# EAGLE design Driver (EAGLE 7.7.0)
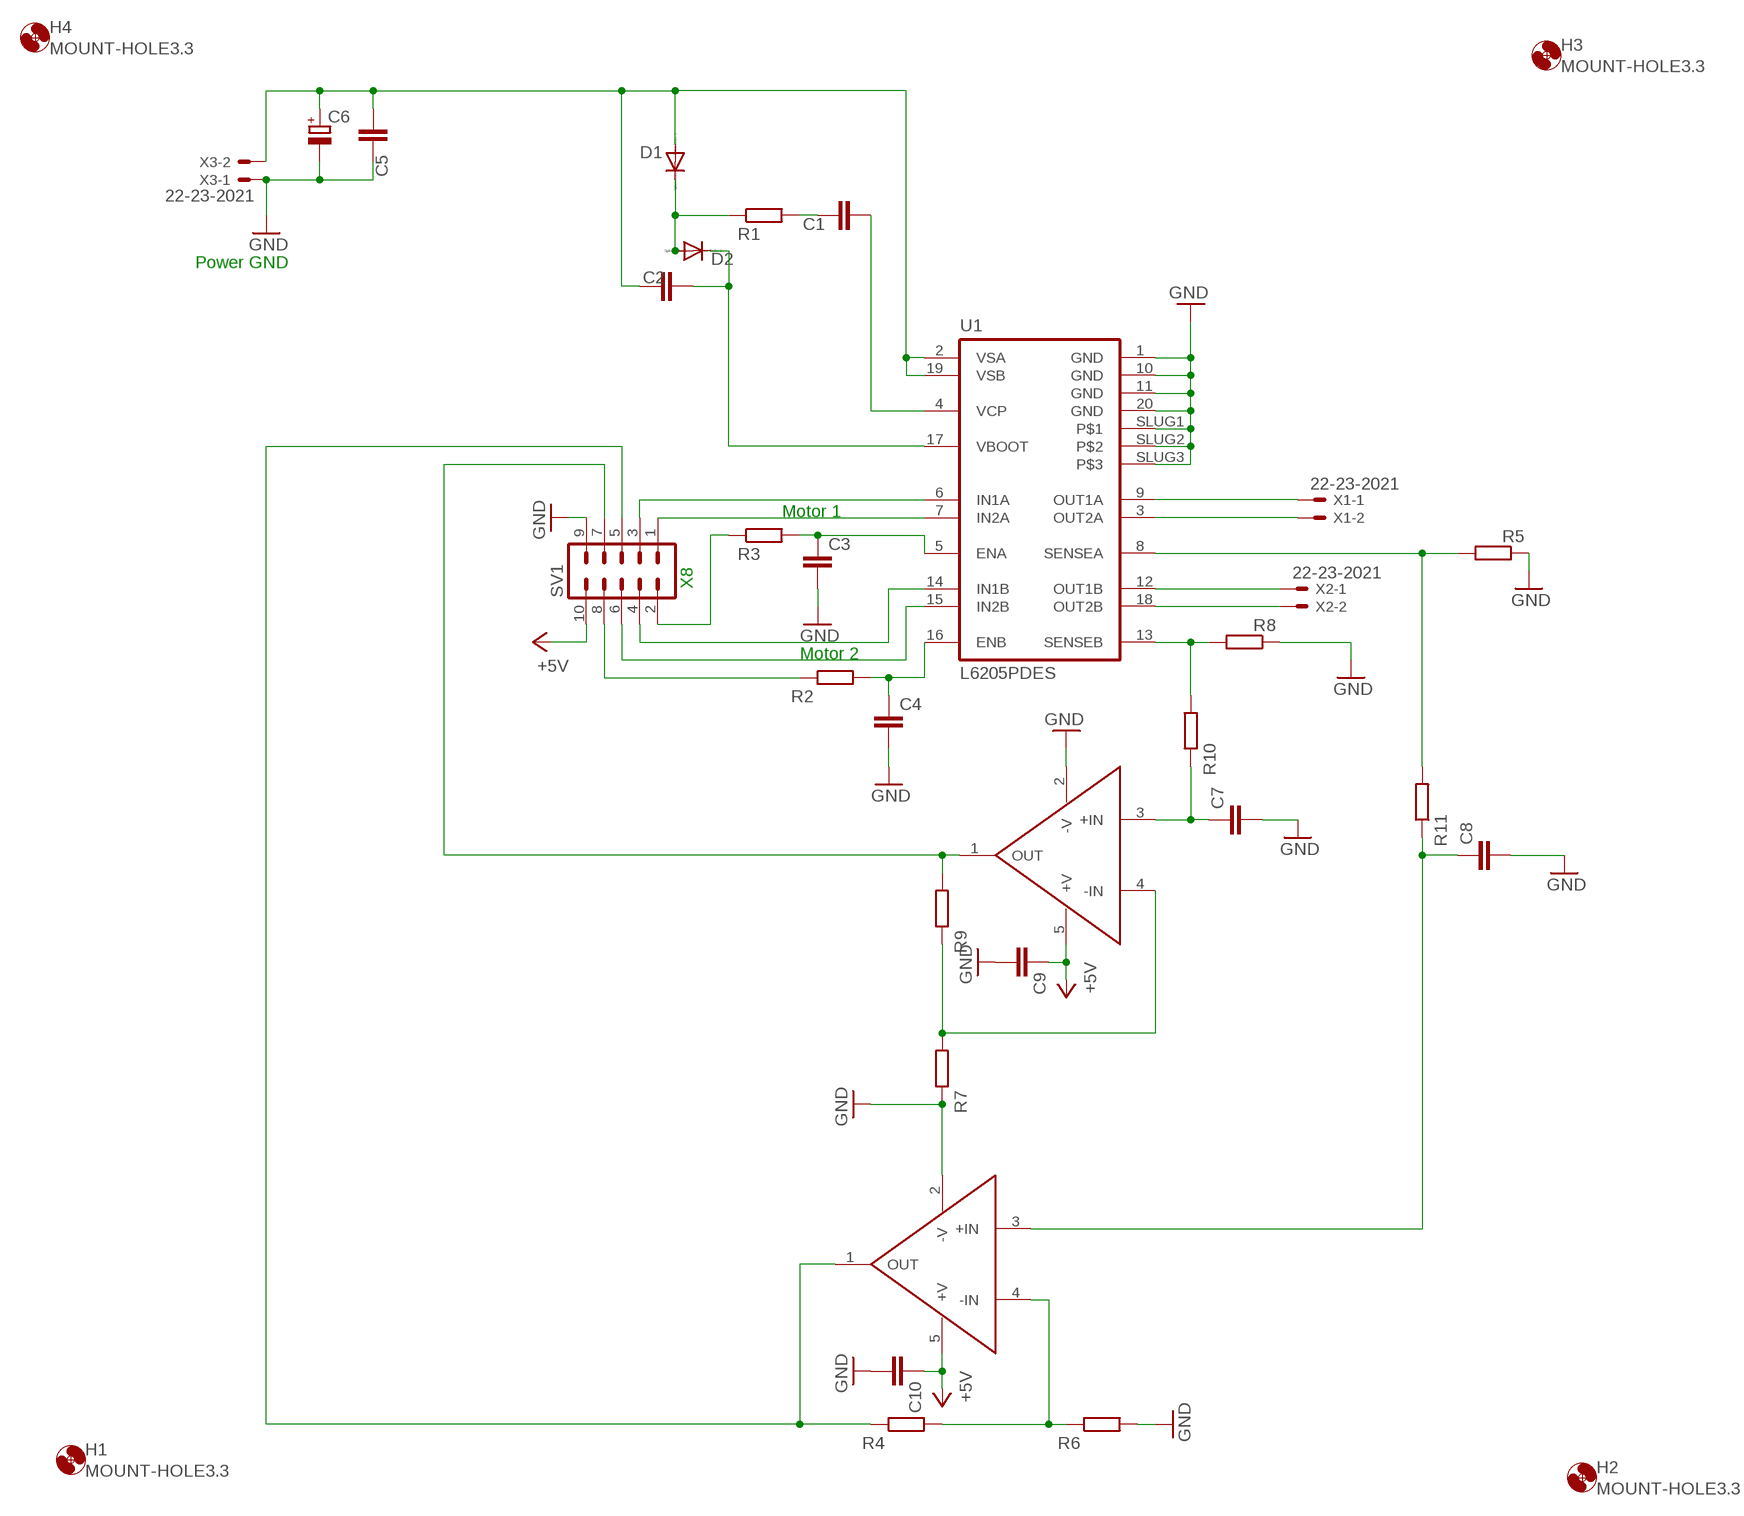
[diagram p0: schematic, sheet 1]

## Parts
C1  C-EUC0805K  [C0805K]
C2  C-EUC0805K  [C0805K]
C3  C-EUC0805  [C0805]
C4  C-EUC0805  [C0805]
C5  C-EUC0805K  [C0805K]
C6  CPOL-EUE  [PANASONIC_E]
C7  C-EUC0805  [C0805]
C8  C-EUC0805  [C0805]
C9  C-EUC0805  [C0805]
C10  C-EUC0805  [C0805]
D1  DIODE-MINIMELF  [MINIMELF]
D2  DIODE-MINIMELF  [MINIMELF]
H1  MOUNT-HOLE3.3  [3,3]
H2  MOUNT-HOLE3.3  [3,3]
H3  MOUNT-HOLE3.3  [3,3]
H4  MOUNT-HOLE3.3  [3,3]
R1  R-EU_MELF0204W  [MINI_MELF-0204W]
R2  R-EU_MELF0204W  [MINI_MELF-0204W]
R3  R-EU_MELF0204W  [MINI_MELF-0204W]
R4  R-EU_MELF0204W  [MINI_MELF-0204W]
R5  R-EU_R2512W  [R2512W]
R6  R-EU_MELF0204W  [MINI_MELF-0204W]
R7  R-EU_MELF0204W  [MINI_MELF-0204W]
R8  R-EU_R2512W  [R2512W]
R9  R-EU_MELF0204W  [MINI_MELF-0204W]
R10  R-EU_MELF0204W  [MINI_MELF-0204W]
R11  R-EU_MELF0204W  [MINI_MELF-0204W]
SV1  ML10  [ML10]
U1  L6205PDES  [SO20POWER2]
U$2  LM7301  [SOT23-5]
U$3  LM7301  [SOT23-5]
X1  22-23-2021  [22-23-2021]
X2  22-23-2021  [22-23-2021]
X3  22-23-2021  [22-23-2021]

## Nets
+5V: C9.1 C10.1 SV1.10 U$2.5(+V) U$3.5(+V)
GND: C3.2 C4.2 C5.1 C6.- C7.2 C8.2 C9.2 C10.2 R5.1 R6.2 R7.1 R8.1 SV1.9 U1.1(GND) U1.10(GND) U1.11(GND) U1.20(GND) U1.SLUG1 U1.SLUG2 U1.SLUG3 U$2.2(-V) U$3.2(-V) X3.1
N$1: C2.1 C5.2 C6.+ D1.A U1.2(VSA) U1.19(VSB) X3.2
N$2: D1.C D2.A R1.1
N$3: C1.1 R1.2
N$4: C1.2 U1.4(VCP)
N$5: C2.2 D2.C U1.17(VBOOT)
N$6: SV1.3 U1.6(IN1A)
N$7: R3.1 SV1.2
N$8: SV1.6 U1.15(IN2B)
N$9: C3.1 R3.2 U1.5(ENA)
N$10: SV1.4 U1.14(IN1B)
N$11: R2.1 SV1.8
N$12: SV1.1 U1.7(IN2A)
N$13: R8.2 R10.2 U1.13(SENSEB)
N$14: C7.1 R10.1 U$3.3(+IN)
N$15: C4.1 R2.2 U1.16(ENB)
N$16: C8.1 R11.1 U$2.3(+IN)
N$17: R4.1 SV1.5 U$2.1(OUT)
N$18: R4.2 R6.1 U$2.4(-IN)
N$19: R5.2 R11.2 U1.8(SENSEA)
N$20: U1.18(OUT2B) X2.2
N$21: U1.12(OUT1B) X2.1
N$22: U1.3(OUT2A) X1.2
N$23: U1.9(OUT1A) X1.1
N$25: R9.2 SV1.7 U$3.1(OUT)
N$26: R7.2 R9.1 U$3.4(-IN)

## Notes on the sheet
- Power GND
- Motor 1
- X8
- Motor 2

## Library data of the parts
C1-C5 C7-C10 = rcl:C-EU: CAPACITOR, European symbol
C6 = rcl:CPOL-EU: POLARIZED CAPACITOR, European symbol
D1 D2 = diode:DIODE-: DIODE
H1-H4 = holes:MOUNT-HOLE: MOUNTING HOLE with drill center marker
R1-R11 = rcl:R-EU_: RESISTOR, European symbol
SV1 = con-harting-ml:ML10: HARTING; OC_FARNELL: unknown; OC_NEWARK: unknown
U1 = ppst002:L6205PD*: L6205PD* DMOS DUAL FULL BRIDGE DRIVER, PowerSO20 outlines Cases: L6205PD (PowerSO20), L6205PDES (extended slug for prototyping (manual soldering issues) Author: Dipl.-Ing. FH Rainer Bayer, rainer.bayer@hs-heilbronn.de, www.ing-rb.de/hhn Notes: 1. Slug: see data sheet (PowerSO20 outline and mechanical data) 2. ENA, ENB pin direction "I/O": see data sheet (ENA and ENB pins open collector driving vs. push-pull driving) 3. SENSEA, SENSEB pin direction "PWR": see data sheet (power ground)
U$2 U$3 = ppst002:LM7301: OpAmp
X1-X3 = con-molex:22-23-2021: .100" (2.54mm) Center Header - 2 Pin; MF: MOLEX; MPN: 22-23-2021; OC_FARNELL: 1462926; OC_NEWARK: 25C3832

## Board
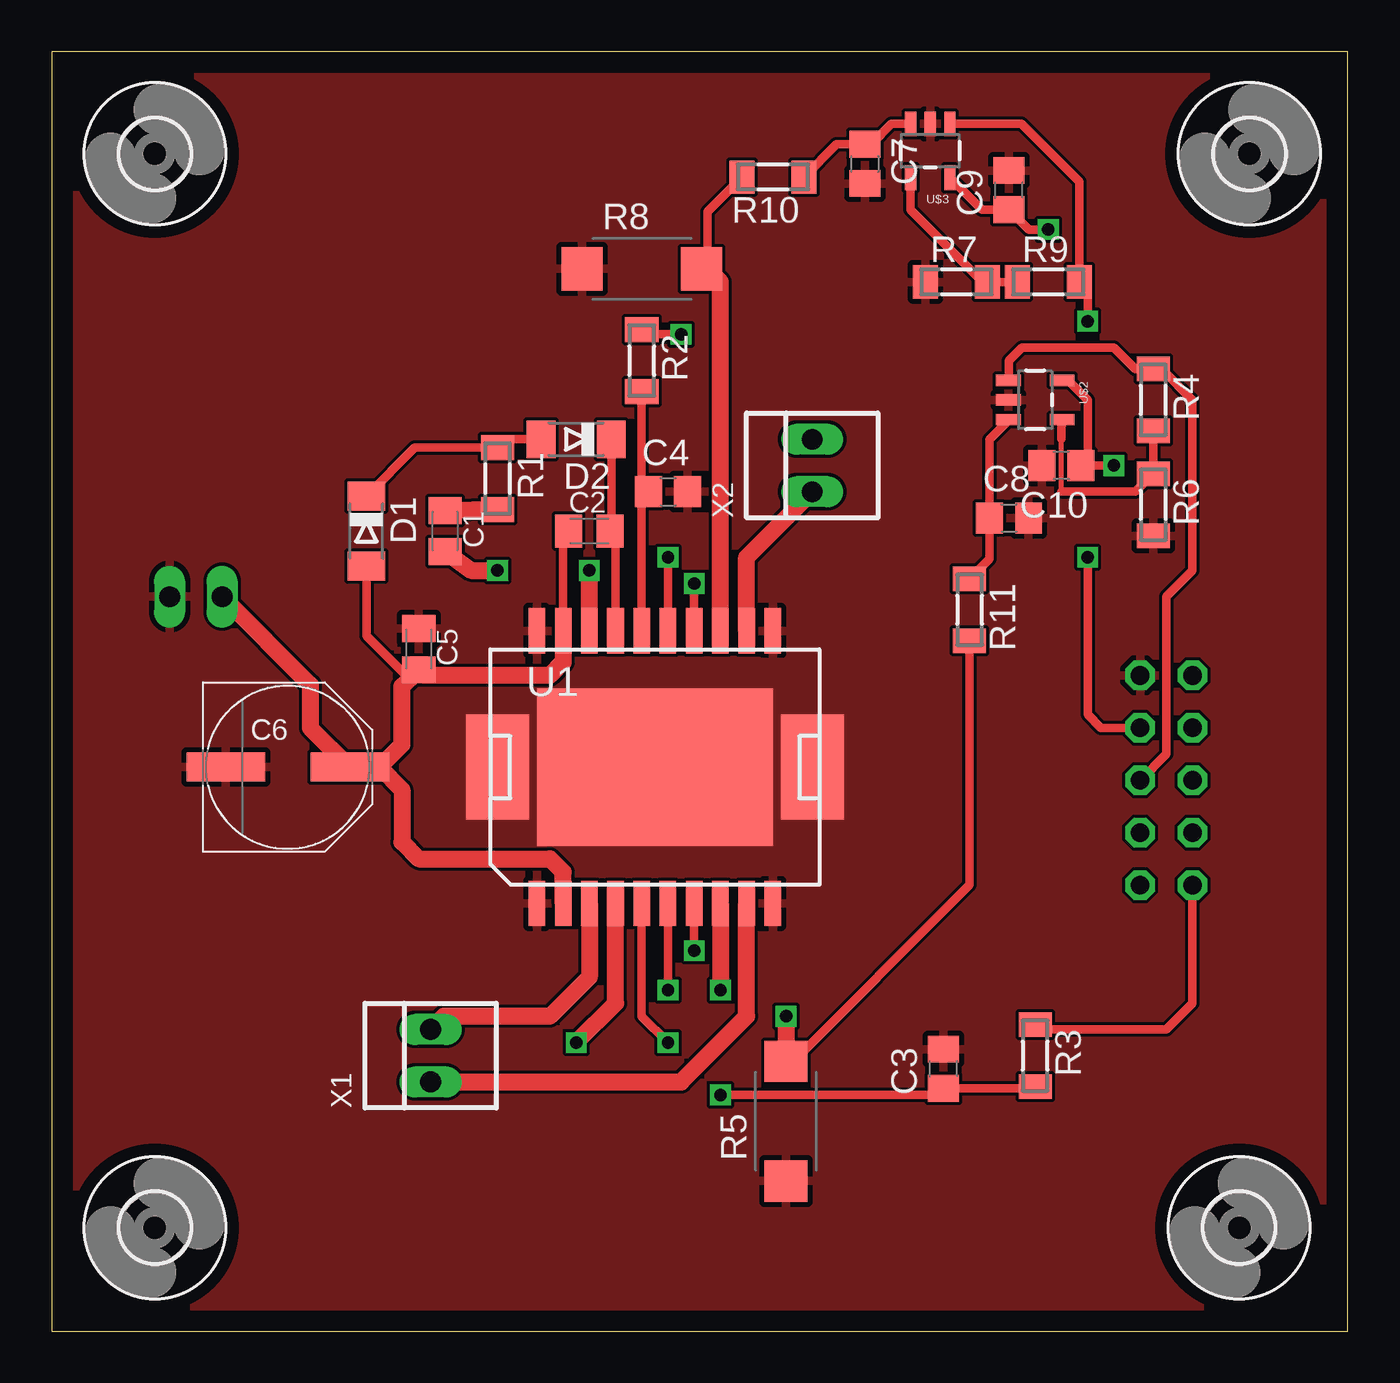
[diagram p1: board, top side]
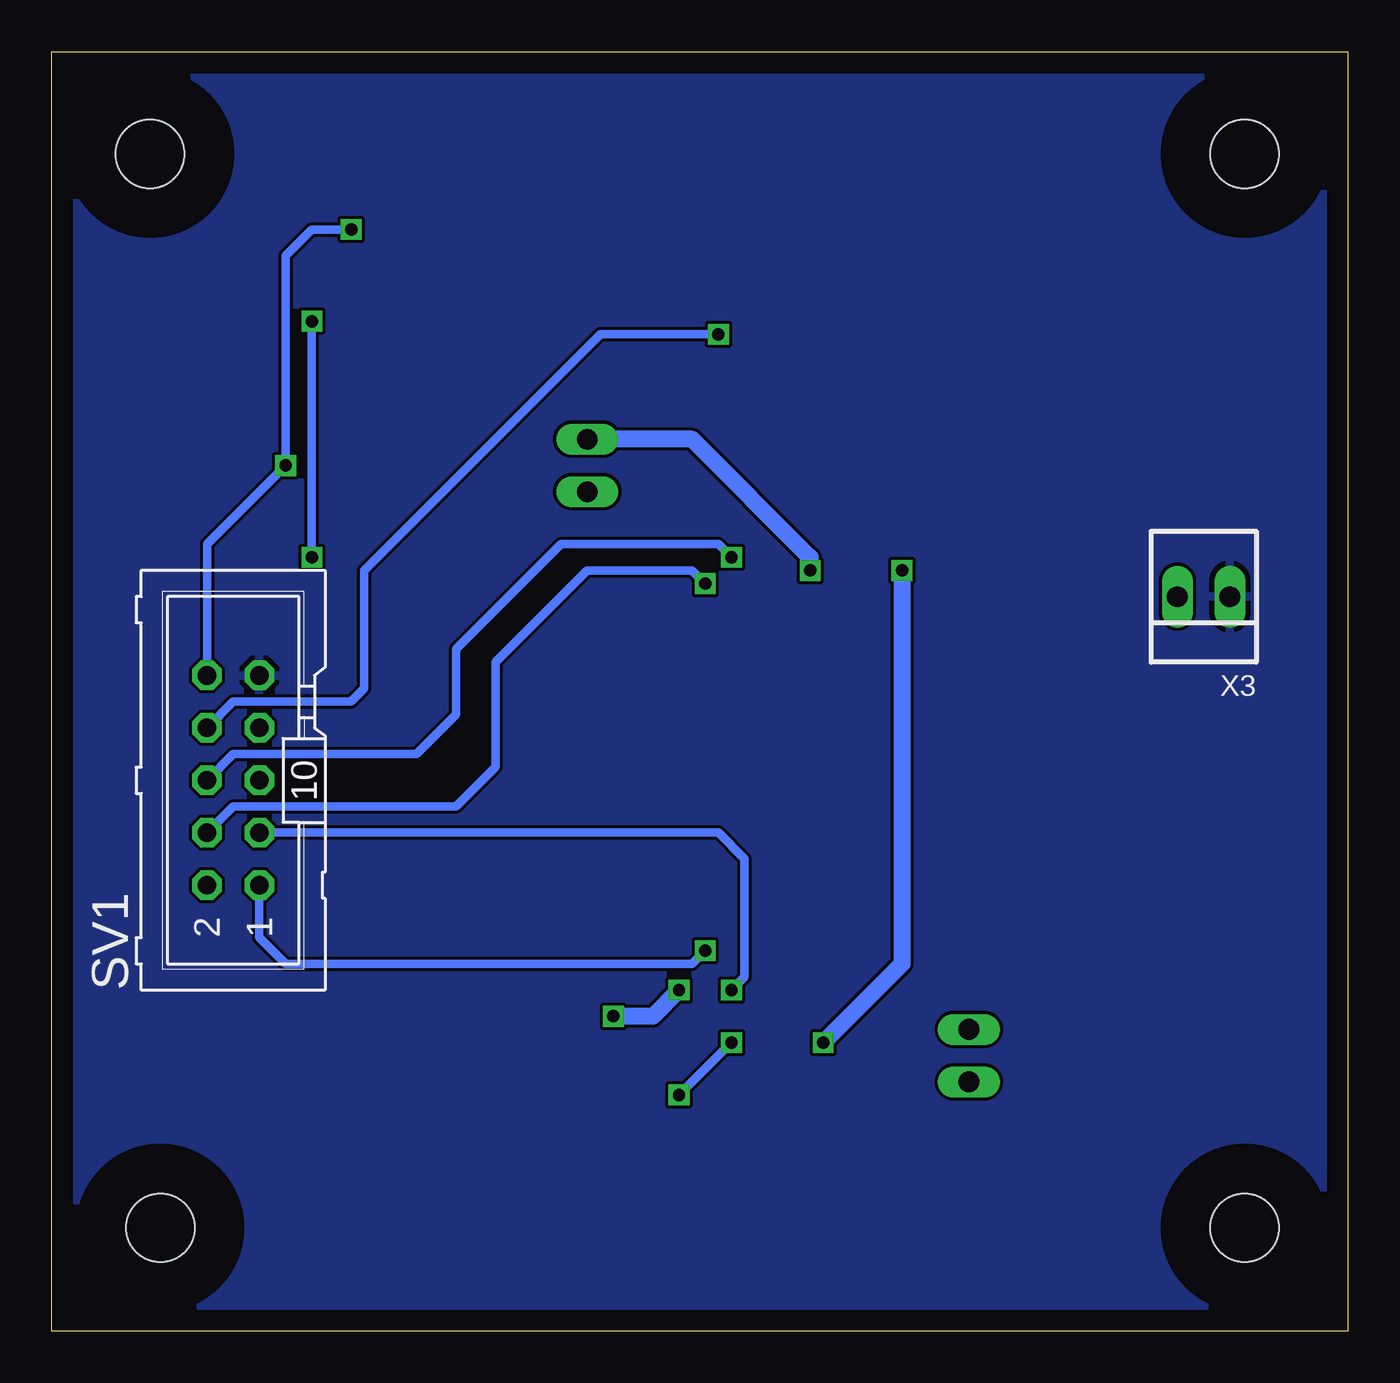
[diagram p2: board, bottom side, seen from below]

Size 62.77 x 61.95 mm. Coordinates in mm from the lower left corner, seen from the top.
Outline: 0,0 62.77,0 62.77,61.95 0,61.95 0,0
Copper layers (1*16): Top 0.035mm / dielectric 1.5mm / Bottom 0.035mm
Design rules "default *": minimum track width 10mil, minimum drill 20mil, track to track 6mil, track to pad 6mil, pad to pad 8mil, via to via 8mil, smd to smd 8mil, copper to edge 40mil, drill to drill 8mil, minimum pad ring 10mil, minimum via ring 8mil, stop-mask expansion 4mil, vias tented up to drill 0mil, thermal gap 10mil

### Footprints (pad centres in the part's own frame; a part is rotated, then mirrored left to right if it is on the bottom)
C0805K = smd 1.3 x 1.6: 1 -1,0; 2 1,0
C0805 = smd 1.3 x 1.5: 1 -0.95,0; 2 0.95,0
PANASONIC_E = smd 3.8 x 1.4: + 3,0; - -3,0
MINIMELF = smd 1.4 x 1.8: A 1.7,0; C -1.7,0
3,3 = hole 3.3: 0,0
MINI_MELF-0204W = smd 1.2 x 1.6: 1 -1.5,0; 2 1.5,0
R2512W = smd 2 x 2.1: 1 -2.896,0; 2 2.896,0
ML10 = drill 0.914 octagon: 1 -5.08,-1.27; 2 -5.08,1.27; 3 -2.54,-1.27; 4 -2.54,1.27; 5 0,-1.27; 6 0,1.27; 7 2.54,-1.27; 8 2.54,1.27; 9 5.08,-1.27; 10 5.08,1.27
SO20POWER2 = smd 0.8 x 2.2: 1 -5.715,-6.6; 2 -4.445,-6.6; 3 -3.175,-6.6; 4 -1.905,-6.6; 5 -0.635,-6.6; 6 0.635,-6.6; 7 1.905,-6.6; 8 3.175,-6.6; 9 4.445,-6.6; 10 5.715,-6.6; 11 5.715,6.6; 12 4.445,6.6; 13 3.175,6.6; 14 1.905,6.6; 15 0.635,6.6; 16 -0.635,6.6; 17 -1.905,6.6; 18 -3.175,6.6; 19 -4.445,6.6; 20 -5.715,6.6 | smd 3.048 x 5.08: SLUG1 -7.62,0; SLUG3 7.62,0 | smd 11.43 x 7.62: SLUG2 0,0
SOT23-5 = smd 0.55 x 1.2: 1 0.32,1.24; 2 1.27,1.24; 3 2.22,1.24; 4 2.22,3.84; 5 0.32,3.84
22-23-2021 = drill 1 long: 1 -1.27,0; 2 1.27,0

### Placement (x,y rotation side)
C1  19.05,38.73 270 top
C2  26.04,38.73 0 top
C3  43.18,12.7 90 top
C4  29.84,40.64 0 top
C5  17.78,33.02 270 top
C6  11.43,27.3 0 top
C7  39.37,56.52 270 top
C8  46.35,39.37 0 top
C9  46.35,55.24 90 top
C10  48.9,41.91 180 top
D1  15.24,38.73 270 top
D2  25.4,43.18 180 top
H1  5,57 0 top
H2  57.5,5 0 top
H3  58,57 0 top
H4  5,5 0 top
R1  21.59,41.27 270 top
R2  28.57,46.99 270 top
R3  47.62,13.34 270 top
R4  53.34,45.09 270 top
R5  35.56,10.16 90 top
R6  53.34,40.01 270 top
R7  43.81,50.8 0 top
R8  28.57,51.44 0 top
R9  48.26,50.8 0 top
R10  34.92,55.88 180 top
R11  44.45,34.92 270 top
SV1  53.98,26.67 90 bottom
U1  29.21,27.3 0 top
U$2  45.09,46.35 270 top
U$3  43.81,59.69 180 top
X1  18.35,13.34 90 top
X2  36.83,41.91 90 top
X3  6.99,35.56 180 bottom

### Tracks (layer width: path | path; a pad name or v marks a point on that pad's centre or on a via)
+5V  (via drill 0.6)
  Top 0.406: 43.49,55.56 U$3.5 45.05,54.3 C9.1 47.31,53.34 v48.26,53.34 | v51.44,41.91 C10.1 50.16,42.23 50.16,45.09 49.22,46.03 U$2.5
  Bottom 0.406: v48.26,53.34 50.16,53.34 51.44,52.07 v51.44,41.91 55.24,38.1 SV1.10
GND
  pour Top: 61.59,60.96 0,60.96 0,0 61.59,0
  pour Bottom: 0,60.96 0,0 61.59,0 61.59,60.96
  pour Top (no thermals): 19.05,32.38 39.37,32.38 39.37,22.23 19.05,22.23
N$1
  Top 0.406: C2.1 24.77,38.47 U1.19 | D1.A 15.24,33.66 17.33,31.57
  Top 0.813: 24.77,20.95 U1.2 24.77,22.23 24.13,22.86 17.78,22.86 16.97,23.67 16.97,26.21 15.88,27.3 | U1.19 24.77,32.38 24.13,31.75 18.05,31.75 C5.2 17.33,31.57 16.97,31.21 16.97,28.4 15.88,27.3 | 15.88,27.3 C6.+ 12.53,29.21 12.53,31.29 X3.2
N$2
  Top 0.406: D2.A 22.23,43.18 21.82,42.77 R1.1 17.58,42.77 D1.C
N$3
  Top 0.813: R1.2 C1.1
N$4  (via drill 0.6)
  Top 0.813: v25.4,13.97 27.3,15.88 U1.4 | C1.2 20.32,36.83 v21.59,36.83
  Bottom 0.813: v21.59,36.83 21.59,17.78 24.13,15.24 v25.4,13.97
N$5
  Top 0.406: U1.17 27.3,38.47 C2.2 27.1,38.8 D2.C
N$6  (via drill 0.6)
  Top 0.406: v29.84,16.51 U1.6
  Bottom 0.406: v29.84,16.51 29.21,17.14 29.21,22.86 30.48,24.13 SV1.3
N$7
  Top 0.406: R3.1 47.85,14.61 53.98,14.61 55.24,15.88 SV1.2
N$8  (via drill 0.6)
  Top 0.406: U1.15 v29.84,37.47
  Bottom 0.406: v29.84,37.47 30.48,38.1 38.1,38.1 43.18,33.02 43.18,29.84 45.09,27.94 53.98,27.94 SV1.6
N$9  (via drill 0.6)
  Top 0.406: U1.5 28.57,15.24 v29.84,13.97 | v32.38,11.43 42.86,11.43 C3.1 47.54,11.75 R3.2
  Bottom 0.406: v29.84,13.97 v32.38,11.43
N$10  (via drill 0.6)
  Top 0.406: U1.14 v31.11,36.2
  Bottom 0.406: v31.11,36.2 31.75,36.83 36.83,36.83 41.27,32.38 41.27,27.3 43.18,25.4 53.98,25.4 SV1.4
N$11  (via drill 0.6)
  Top 0.406: v30.48,48.26 28.57,48.26 R2.1
  Bottom 0.406: v30.48,48.26 36.2,48.26 47.62,36.83 47.62,31.11 48.26,30.48 53.98,30.48 SV1.8
N$12  (via drill 0.6)
  Top 0.406: U1.7 v31.11,18.41
  Bottom 0.406: v31.11,18.41 31.75,17.78 51.44,17.78 52.7,19.05 SV1.1
N$13
  Top 0.406: R8.2 31.75,51.44 31.75,54.2 R10.2
  Top 0.813: U1.13 32.38,50.8 31.75,51.44
N$14
  Top 0.406: U$3.3 40.67,58.45 39.69,57.47 C7.1 38.01,57.47 R10.1
N$15
  Top 0.406: R2.2 28.57,40.64 | 28.57,40.64 U1.16 | C4.1 28.57,40.64
N$16
  Top 0.406: U$2.3 46.35,44.1 45.41,43.16 C8.1 45.41,37.38 R11.1
N$17
  Top 0.406: U$2.1 46.35,46.06 46.35,46.99 46.99,47.62 51.44,47.62 52.48,46.59 R4.1 53.74,46.59 55.24,45.09 55.24,36.83 53.98,35.56 53.98,27.94 SV1.5
N$18
  Top 0.254: 48.9,40.64 48.9,43.18
  Top 0.406: R4.2 R6.1 52.48,40.64 48.9,40.64 | 48.9,43.18 48.9,43.81 48.92,43.84 U$2.4
N$19  (via drill 0.6)
  Top 0.406: R11.2 44.45,21.59 35.56,12.7 R5.2
  Top 0.813: U1.8 v32.38,16.51 | 35.84,13.06 R5.2 v35.56,15.24
  Bottom 0.813: v32.38,16.51 33.66,15.24 v35.56,15.24
N$20  (via drill 0.6)
  Top 0.813: U1.18 v26.04,36.83
  Bottom 0.813: v26.04,36.83 26.04,37.47 31.75,43.18 X2.2
N$21
  Top 0.813: U1.12 33.66,37.47 X2.1
N$22
  Top 0.813: U1.3 26.04,17.14 24.13,15.24 18.98,15.24 X1.2
N$23
  Top 0.813: X1.1 30.48,12.06 33.66,15.24 U1.9
N$25  (via drill 0.6)
  Top 0.406: SV1.7 50.8,29.21 50.16,29.84 v50.16,37.47 | v50.16,48.9 50.16,50.4 R9.2 49.76,55.65 46.96,58.45 U$3.1
  Bottom 0.406: v50.16,37.47 v50.16,48.9
N$26
  Top 0.406: R9.1 R7.2 45.09,50.8 41.59,54.29 U$3.4